# Altium schematic sheet Waveshape_LFO_v1_Main.SchDoc
size A
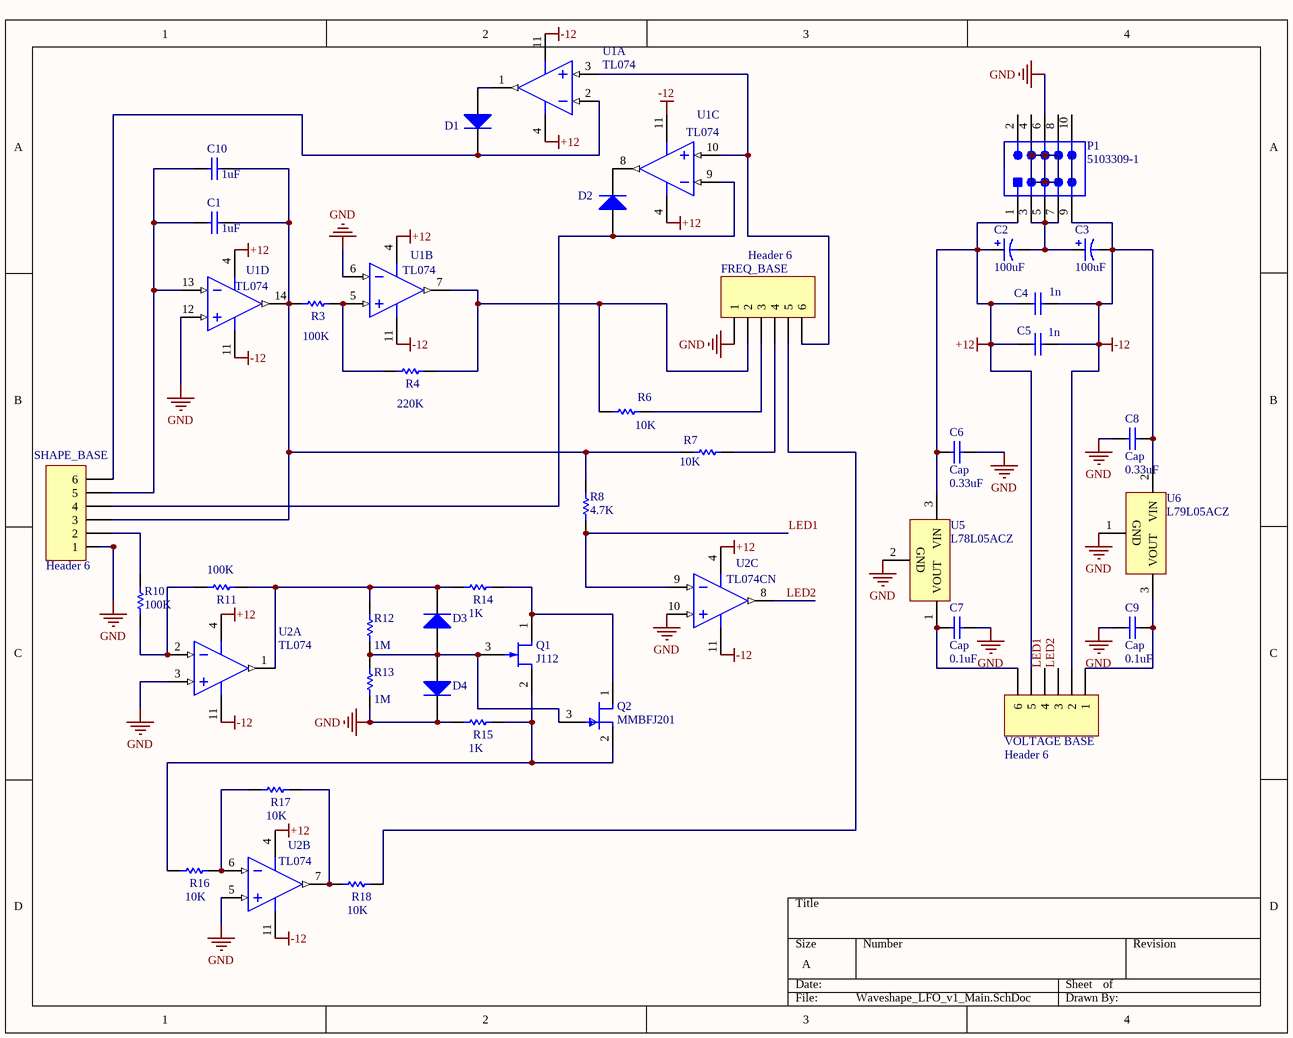
[diagram p0: Waveshape_LFO_v1_Main.SchDoc]

## Parts
C1  value 1uF  [RAD-0.1]  (hidden comment: Cap)
C2  value 100uF  [CAPR5-4X5]  (hidden comment: Cap Pol1)
C3  value 100uF  [CAPR5-4X5]  (hidden comment: Cap Pol1)
C4  value 1n  [RAD-0.1]  (hidden comment: Cap)
C5  value 1n  [RAD-0.1]  (hidden comment: Cap)
C6  Cap  value 0.33uF  [RAD-0.3]
C7  Cap  value 0.1uF  [RAD-0.3]
C8  Cap  value 0.33uF  [RAD-0.3]
C9  Cap  value 0.1uF  [RAD-0.3]
C10  value 1uF  [RAD-0.1]  (hidden comment: Cap)
D1  Diode 1N4148  [DO-35]  (value not drawn)
D2  Diode 1N4148  [DO-35]  (value not drawn)
D3  1N4148  [DO-35]  (value not drawn)
D4  Diode 1N4148  [DO-35]  (value not drawn)
FREQ_BASE  Header 6  [HDR1X6]
P1  5103309-1  [TECO-5103309-1_V]
Q1  J112  [ONSC-TO-92-3-29-11]
Q2  MMBFJ201  [FP-318BM-IPC_C]
R3  value 100K  [AXIAL-0.3]
R4  value 220K  [AXIAL-0.3]
R6  value 10K  [AXIAL-0.3]
R7  value 10K  [AXIAL-0.3]
R8  value 4.7K  [AXIAL-0.3]
R10  value 100K  [AXIAL-0.3]
R11  value 100K  [AXIAL-0.3]
R12  value 1M  [AXIAL-0.3]
R13  value 1M  [AXIAL-0.3]
R14  value 1K  [AXIAL-0.3]
R15  value 1K  [AXIAL-0.3]
R16  value 10K  [AXIAL-0.3]
R17  value 10K  [AXIAL-0.3]
R18  value 10K  [AXIAL-0.3]
SHAPE_BASE  Header 6  [HDR1X6]
U1  TL074  [N0014A]  (parts A,B,C,D of 4)
U2  TL074  [N0014A]  (parts A,B,C of 4)
U5  L78L05ACZ  [TO-92]
U6  L79L05ACZ  [TO-92]
VOLTAGE_BASE  Header 6  [HDR1X6]

## Nets
+12: C2.1 C4.1 C5.1 C6.1 P1.1 U1.4(VCC+) U2.4(VCC+) U5.3(VIN) VOLTAGE_BASE.5
-12: C3.2 C4.2 C5.2 C8.2 P1.9 U1.11(VCC-) U2.11(VCC-) U6.2(VIN) VOLTAGE_BASE.2
GND: C6.2 C7.2 C8.1 C9.1 D4.2(K) FREQ_BASE.1 P1.6 R13.1 R15.1 SHAPE_BASE.1 U1.6(IN2-) U1.12(IN4+) U2.3(IN1+) U2.5(IN2+) U2.10(IN3+) U5.2(GND) U6.1(GND)
LED1: R8.1 U2.9(IN3-) VOLTAGE_BASE.4
LED2: U2.8(OUT3) VOLTAGE_BASE.3
NetC1_1: C1.1 C10.1 SHAPE_BASE.5 U1.13(IN4-)
NetC1_2: C1.2 C10.2 R3.1 R7.2 R8.2 SHAPE_BASE.3 U1.14(OUT4)
NetC2_2: C2.2 C3.1 P1.3 P1.5 P1.7
NetC7_1: C7.1 U5.1(VOUT) VOLTAGE_BASE.6
NetC9_2: C9.2 U6.3(VOUT) VOLTAGE_BASE.1
NetD1_1: D1.1(A) U1.1(OUT1)
NetD1_2: D1.2(K) SHAPE_BASE.6 U1.2(IN1-)
NetD2_1: D2.1(A) SHAPE_BASE.4 U1.9(IN3-)
NetD2_2: D2.2(K) U1.8(OUT3)
NetD3_1: D3.1(A) D4.1(A) Q1.3(G) Q2.3(G) R12.1 R13.2
NetD3_2: D3.2(K) R11.2 R12.2 R14.1 U2.1(OUT1)
NetFREQ_BASE_2: FREQ_BASE.2 R4.2 R6.1 U1.7(OUT2)
NetFREQ_BASE_3: FREQ_BASE.3 R6.2
NetFREQ_BASE_4: FREQ_BASE.4 R7.1
NetFREQ_BASE_5: FREQ_BASE.5 R18.2
NetFREQ_BASE_6: FREQ_BASE.6 U1.3(IN1+) U1.10(IN3+)
NetQ1_1: Q1.1(D) Q2.1(D) R14.2
NetQ1_2: Q1.2(S) Q2.2(S) R15.2 R16.1
NetR3_2: R3.2 R4.1 U1.5(IN2+)
NetR10_1: R10.1 R11.1 U2.2(IN1-)
NetR10_2: R10.2 SHAPE_BASE.2
NetR16_2: R16.2 R17.1 U2.6(IN2-)
NetR17_2: R17.2 R18.1 U2.7(OUT2)

Not connected (* = marked no-connect by the designer): P1 2 4 8 10

## Library data of the parts
C1 C4-C10 = Cap: Capacitor; Published: 8-Jun-2000; LatestRevisionDate: 17-Jul-2002; LatestRevisionNote: Re-released for DXP Platform.; PackageReference: RAD-0.3; Publisher: Altium Limited; PackageDescription: Radial Cap, Thru-Hole; 2 Leads; 0.3 in Pin Spacing
C2 C3 = Cap Pol1: Polarized Capacitor (Radial); Published: 8-Jun-2000; LatestRevisionDate: 17-Jul-2002; LatestRevisionNote: Re-released for DXP Platform.; PackageReference: RB7.6-15; Publisher: Altium Limited; PackageDescription: Polarized Capacitor (Radial); 2 Leads
D1-D4 = Diode 1N4148: High Conductance Fast Diode; Published: 8-Jun-2000; LatestRevisionDate: 17-Jul-2002; LatestRevisionNote: Re-released for DXP Platform.; DatasheetVersion: 1997; PackageReference: DO-35; Publisher: Altium Limited; PackageDescription: Diode, Axial; Body 3.8 x 1.9 mm (LxDia. max), Lead Dia. 0.53 mm (max); Code_JEDEC: DO-204-AH; ComponentLink1Description: Manufacturer Link; ComponentLink1URL: http://www.fairchildsemi.com/; ComponentLink2Description: Datasheet; ComponentLink2URL: http://www.fairchildsemi.com/ds/1N%2F1N4148.pdf
FREQ_BASE SHAPE_BASE VOLTAGE_BASE = Header 6: Header, 6-Pin; System: Connector; LatestRevisionDate: 17-Jul-2002; LatestRevisionNote: Re-released for DXP Platform.; Publisher: Altium Limited; Parameter 1: *
P1 = CMP-2000-07502-1: Male Header, Pitch 2.54 mm, 2 x 5 Position, Height 9.855 mm, Tail Length 3.048 mm, -65 to 105 degC, RoHS, Tube; Manufacturer: TE Connectivity; PCB Mounting Orientation: Vertical; Pitch: 2.54mm; Mating Connector Lock: No(Without); Body Material: Thermoplastic; Shrouded: Yes(With); Connector System: Wire-to-Board; Insulation Resistance: 5GR; Number of Positions: 10; Max Current Rating: 1A; PCB Mount Retention: Without; Manufacturer URL: http://www.te.com/; Contact Plating: Gold; Datasheet URL: http://www.te.com/commerce/DocumentDelivery/DDEController?Action=showdoc&DocId=Customer+Drawing%7F5103309%7FE1%7Fpdf%7FEnglish%7FENG_CD_5103309_E1.pdf%7F5103309-1; Colour: Black; Termination: ThroughHole; Housing Colour: Black; Flammability Rating: UL94V-0; Package Description: Male Header, Pitch 2.54 mm, 2 x 5 Position, Height 9.855 mm, Tail Length 3.048 mm; Mating Retention: No(Without); Orientation: Straight; Row Spacing: 2.54mm; Termination Post Length: 0.12inch; Min Operating Temperature: -65degC; Board Standoff: Yes(With); REACH SVHC: NoSVHC; Depth: 9.14mm; Lead Free: LeadFree; Gender: Male; Connector Type: Header; Shrouded End Dimension: 3.81mm; ELV: Compliant; Mating Alignment: Yes(With); Panel Mount Retention: No(Without); Package Quantity: 35; PCB Mount Alignment: No(Without); Number of Rows: 2; Package Reference: 5103309-1; Mounting Technology: ThroughHole; Mount: ThroughHole; Contact Gender: Male; Number of Contacts: 10; Length: 0.8inch; Current Rating: 1A; Contact Mating Length: 0.24inch; Max Operating Temperature: 105degC; RoHSCompliant: True; Datasheet Version: Rev. E1, 03/2011; Contact Shape: Square; Height: 8.813mm; Housing Material: PBT; Contact Material: CopperAlloy; Packaging: Rail/Tube
Q1 = CMP-1062-00071-1: JFET Chopper Transistor, N-Channel - Depletion, 3-Pin TO-92, Bulk Box; Manufacturer: On Semiconductor; Channel Polarity: N Channel; V(BR)GSS Min (V): 35; PackageVersion: Rev. AM; ComponentLink3URL: http://www.onsemi.cn/pub_link/Collateral/2N6426-D.PDF; ComponentLink2Description: Datasheet; Packing: Bulk Box; DatasheetVersion: Rev. 2; Mounting Technology: Through Hole; PackageReference: TO-92-3-29-11_AM_SL; ComponentLink2URL: http://www.onsemi.com/pub_link/Collateral/J111-D.PDF; ComponentLink1URL: http://www.onsemi.com/; ComponentLink3Description: Package Specification; PartNumber: J112; PackageDescription: 3-Pin Transistor Outline, Body 4.825 x 3.685 mm, Pitch 1.27 mm; ComponentLink1Description: Manufacturer URL
Q2 = CMP-07172-000003-1: JFET N-CH 40V 350MW SOT23; Manufacturer: ON Semiconductor; Number Of Channels: 1; Rthja Max: 357°C/W; Gate To Source Voltage: -40V; Continuous Drain Current: 1mA; Standoff Height: 0mm; Description: JFET N-Channel 40V  350mW Surface Mount SOT-23-3; Max Junction Temp: +150°C; Temperature Range Low: -55°C; Number Of N Channels: 1; Power Dissipation: 350mW; Height: 1.2mm; Lead Free: Yes; Automotive: No; ComponentLink2Description: Datasheet; RoHS: TRUE; Temperature Range High: +150°C; Temperature: -55°C to +150°C; Device Class L3: JFETs; Device Class L1: Discrete Semiconductors; Device Class L2: Transistors; Footprint Url: https://www.onsemi.com/pub/Collateral/318BM.PDF; Ipc Land Pattern Name: SOT95P240X120-3; ComponentLink2URL: https://www.onsemi.com/pub/Collateral/MMBFJ202-D.pdf; Digikey Description: JFET N-CH 40V 350MW SOT23; Octopart: https://octopart.com/mmbfj201-on+semiconductor-84330255; Breakdown Voltage: -40V; Manufacturer Part Number: MMBFJ201; Category: Trans; Package: 318BM; Mouser Description: JFET N-Channel Transistor General Purpose
R3 R4 R6-R8 R10-R18 = Res1: Resistor; Published: 8-Jun-2000; LatestRevisionDate: 17-Jul-2002; LatestRevisionNote: Re-released for DXP Platform.; PackageReference: AXIAL-0.3; Publisher: Altium Limited; PackageDescription: Axial Device, Thru-Hole; 2 Leads; 0.3 in Pin Spacing
U1 U2 = CMP-0015-00129-2: Quad Low-Noise JFET-Input General-Purpose Operational Amplifier, 7 to 36 V, 0 to 70 degC, 14-pin DIP (N14), Pb-Free (RoHS); Manufacturer: Texas Instruments; PartNumber: TL074CN; Rating: Military; Total Supply Voltage(Max)(+5V is 5, +/-5V is 10): 36; IIB(Max)(pA): 200; Number of Channels: 4; Sub Family: General Purpose Amplifier, High Supply Voltage Amplifier (>=30V); Vio (25C)(Max)(mV): 10; Iq per channel(Max)(mA): 2.5; Total Supply Voltage(Min)(+5V is 5, +/-5V is 10): 7; Vn at 1kHz(Typ)(nV/rtHz): 18; Slew Rate(Typ)(V/us): 13; GBW(Typ)(MHz): 3; CMRR(Min)(dB): 70; DatasheetVersion: SLOS080J; ComponentLink2Description: Datasheet; ComponentLink2URL: http://www.ti.com/lit/ds/symlink/tl074.pdf; ComponentLink3URL: http://www.ti.com/lit/ml/mpdi002c/mpdi002c.pdf; PackageDescription: 14-Pin Plastic In-Line, Body 19.305 x 6.35 mm, Pitch 2.54 mm; Eco-Plan: Pb-Free (RoHS); ComponentLink1Description: Manufacturer URL; PackageReference: N0014A; ComponentLink3Description: Package Specification; Mounting Technology: Through Hole; PackageVersion: 4040049/E, 12/2002; ComponentLink1URL: http://www.ti.com/; Offset Drift(Typ)(uV/C): 18; Code_JEDEC: MS-001
U5 = CMP-0244-00012-1: Positive Voltage Regulator, 5V, 3-Pin TO-92; ComponentLink2Description: Datasheet; ComponentLink1URL: http://www.st.com; ComponentLink2URL: http://www.st.com/internet/com/TECHNICAL_RESOURCES/TECHNICAL_LITERATURE/DATASHEET/CD00000446.pdf; PackageVersion: 2011; DatasheetVersion: 1/02/2011; PackageReference: TO-92; PackageDescription: TO, Flat Index; 3 In-Line, Axial Leads; Body Dia. 4.7mm; Lead Dia. 0.56 mm (max); ComponentLink1Description: Manufacturer URL
U6 = CMP-0244-00030-1: Negative Voltage Regulator, -5V, 3-Pin TO-92; ComponentLink1URL: http://www.st.com; ComponentLink1Description: Manufacturer URL; PackageReference: TO-92; ComponentLink2Description: Datasheet; ComponentLink2URL: http://www.st.com/internet/com/TECHNICAL_RESOURCES/TECHNICAL_LITERATURE/DATASHEET/CD00000539.pdf; DatasheetVersion: 1/07/2009; PackageVersion: 2011; PackageDescription: TO, Flat Index; 3 In-Line, Axial Leads; Body Dia. 4.7mm; Lead Dia. 0.56 mm (max)